# Altium schematic sheet Power_Supply_TLVM13630.SchDoc
size A4
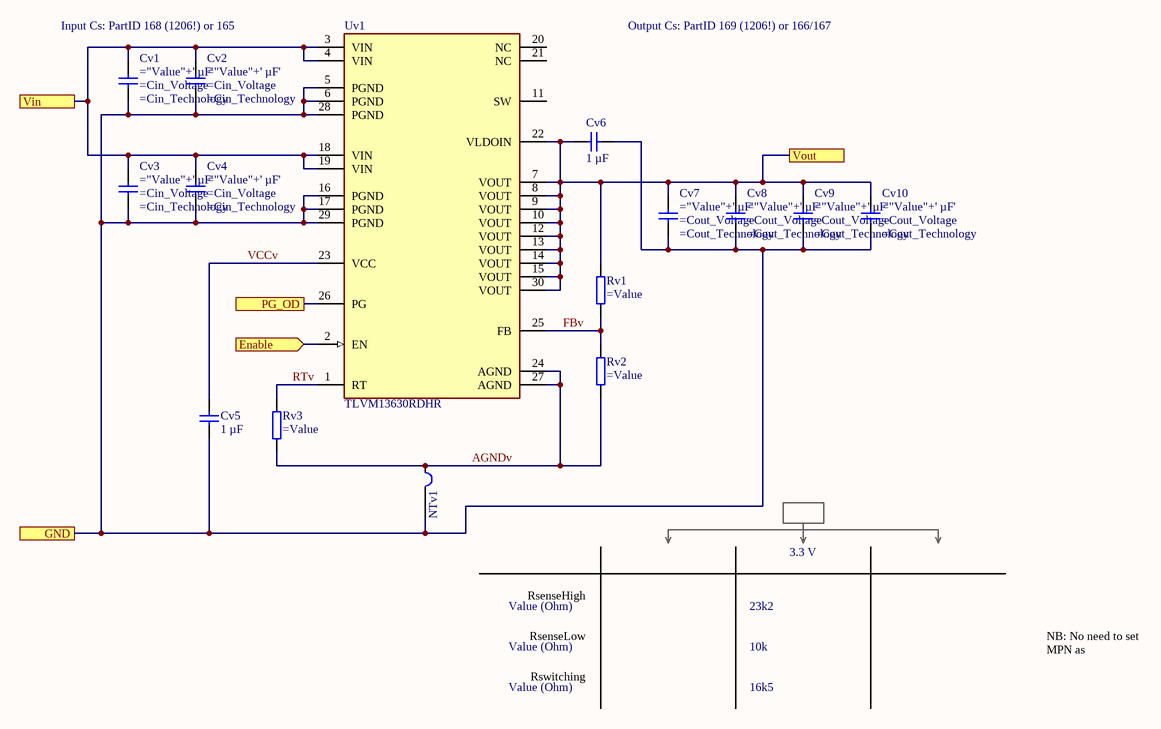
[diagram p0: Power_Supply_TLVM13630.SchDoc]

## Parts
Cv1  (no value)  [C_1210_TE]
Cv2  (no value)  [C_1210_TE]
Cv3  (no value)  [C_1210_TE]
Cv4  (no value)  [C_1210_TE]
Cv5  1 µF  [C_0603_TE]
Cv6  1 µF  [C_0603_TE]
Cv7  (no value)  [C_1210_TE]
Cv8  (no value)  [C_1210_TE]
Cv9  (no value)  [C_1210_TE]
Cv10  (no value)  [C_1210_TE]
NTv1  Net Tie 1 to 1  [1_to_1_NetTie_0.1mm-NoOverlayPrint]  (value not drawn)  (net tie, no BOM)
Rv1  (no value)  [R_0603_TE]
Rv2  (no value)  [R_0603_TE]
Rv3  (no value)  [R_0603_TE]
Uv1  TLVM13630RDHR  [FP-RDH0030A-MFG_CUSTOMBOTSMETENTED]

## Ports
Enable (in), GND, PG_OD, Vin, Vout

## Nets
AGNDv: NTv1.1 Rv2.2 Rv3.2 Uv1.24(AGND) Uv1.27(AGND)
Enable: Uv1.2(EN) ; port Enable
FBv: Rv1.2 Rv2.1 Uv1.25(FB)
GND: Cv1.1 Cv2.1 Cv3.1 Cv4.1 Cv5.1 Cv6.1 Cv7.1 Cv8.1 Cv9.1 Cv10.1 NTv1.2 Uv1.5(PGND) Uv1.6(PGND) Uv1.16(PGND) Uv1.17(PGND) Uv1.28(PGND) Uv1.29(PGND) ; port GND
PG_OD: Uv1.26(PG) ; port PG_OD
RTv: Rv3.1 Uv1.1(RT)
VCCv: Cv5.2 Uv1.23(VCC)
Vin: Cv1.2 Cv2.2 Cv3.2 Cv4.2 Uv1.3(VIN) Uv1.4(VIN) Uv1.18(VIN) Uv1.19(VIN) ; port Vin
Vout: Cv6.2 Cv7.2 Cv8.2 Cv9.2 Cv10.2 Rv1.1 Uv1.7(VOUT) Uv1.8(VOUT) Uv1.9(VOUT) Uv1.10(VOUT) Uv1.12(VOUT) Uv1.13(VOUT) Uv1.14(VOUT) Uv1.15(VOUT) Uv1.22(VLDOIN) Uv1.30(VOUT) ; port Vout

Not connected (* = marked no-connect by the designer): Uv1 11(SW) 20(NC) 21(NC)

## Notes on the sheet
- Input Cs: PartID 168 (1206!) or 165
- Output Cs: PartID 169 (1206!) or 166/167
- RsenseHigh (@{"Id":"LFLUCUDE\CWKSXVTH","ObjectType":2})
- 3.3 V
- RsenseLow (@{"Id":"LFLUCUDE\OYRSSWGH","ObjectType":2})
- Value (Ohm)
- 23k2
- 10k
- NB: No need to set MPN as parameter!
- Rswitching (@{"Id":"LFLUCUDE\ATKBNENF","ObjectType":2})
- 16k5
- Title
- Revision:
- Design Engineer:
- Date:
- Project:
- Sheet
- of

## Library data of the parts
Cv1-Cv4 Cv7-Cv10 = UZgen_C_1210_ParaC: Generic capacitor (parametric); Manufacturer: UZgen; Tolerance: 10 %; Created from: UZgenTool; Manufacturer Part Number: ='UZgen_C_1210_'+"Value"+'uF_'+"Voltage"+'_'+"Technology"; PartID: 5823; Created On: 29/03/2025 17:15:00; Device Package: 1210; Mounting Type: SMD; Last Updated: 02/04/2025 19:05:00
  Cv1-Cv4: Value: =Cin_µF; Voltage: =Cin_Voltage; Technology: =Cin_Technology
  Cv7-Cv10: Value: =Cout_µF; Voltage: =Cout_Voltage; Technology: =Cout_Technology
Cv5 Cv6 = UZgen_C_0603_1uF_16V_X7R: Generic capacitor; Manufacturer: UZgen; Voltage: 16V; Tolerance: 10 %; Created from: UZgenTool; Manufacturer Part Number: UZgen_C_0603_1uF_16V_X7R; PartID: 3783; Created On: 02/08/2024 11:17:59; Value: 1 µF; Device Package: 0603; Technology: X7R; Mounting Type: SMD; Last Updated: 02/08/2024 11:17:59
NTv1 = Net Tie 1 to 1: Net Tie 1 to 1. Joins two nets without producing a DRC error or renaming one of the nets; PartID: 2; Created On: 29/09/2024 15:25:00; Component Type: Net Tie 1 to 1; Last Updated: 19/03/2025 20:40:00; Type: Net Tie (No BOM); Created by: MGeier; Live Cycle Status: 1
Rv1-Rv3 = UZgen_R_0603_ParaR: Generic resistor (parametric); Manufacturer: UZgen; Tolerance: 1 %; Created from: UZgenTool; Manufacturer Part Number: ='UZgen_R_0603_'+"Value"; PartID: 588; Created On: 08/07/2024 14:34:30; Device Package: 0603; Mounting Type: SMD; Last Updated: 08/07/2024 14:34:30
  Rv1: Value: =RsenseHigh_Ohm
  Rv2: Value: =RsenseLow_Ohm
  Rv3: Value: =Rswitching_Ohm
Uv1 = TLVM13630RDHR: 3-V to 36-V Input, 1-V to 6-V Output, 3-A Power Module with integrated shielded inductor; Manufacturer: Texas Instruments; Created from: MGeier; Manufacturer Part Number: TLVM13630RDHR; PartID: 16; Created On: 13/03/2025 17:08:45; ComponentLink1Description: Datasheet; ComponentLink1URL: https://www.ti.com/lit/ds/symlink/tlvm13630.pdf; Component Type: DC/DC module; Device Package: B0QFN (4x6mm²); Last Updated: 28/05/2025 13:38:45; Mounting Type: SMD; Operating Temperature: -40 - 125 °C; Supplier 1: LCSC; Supplier Part Number 1: C5219304; Type: DC/DC module; Live Cycle Status: 1; LCSC Part Number: C5219304; Stock number: not stored